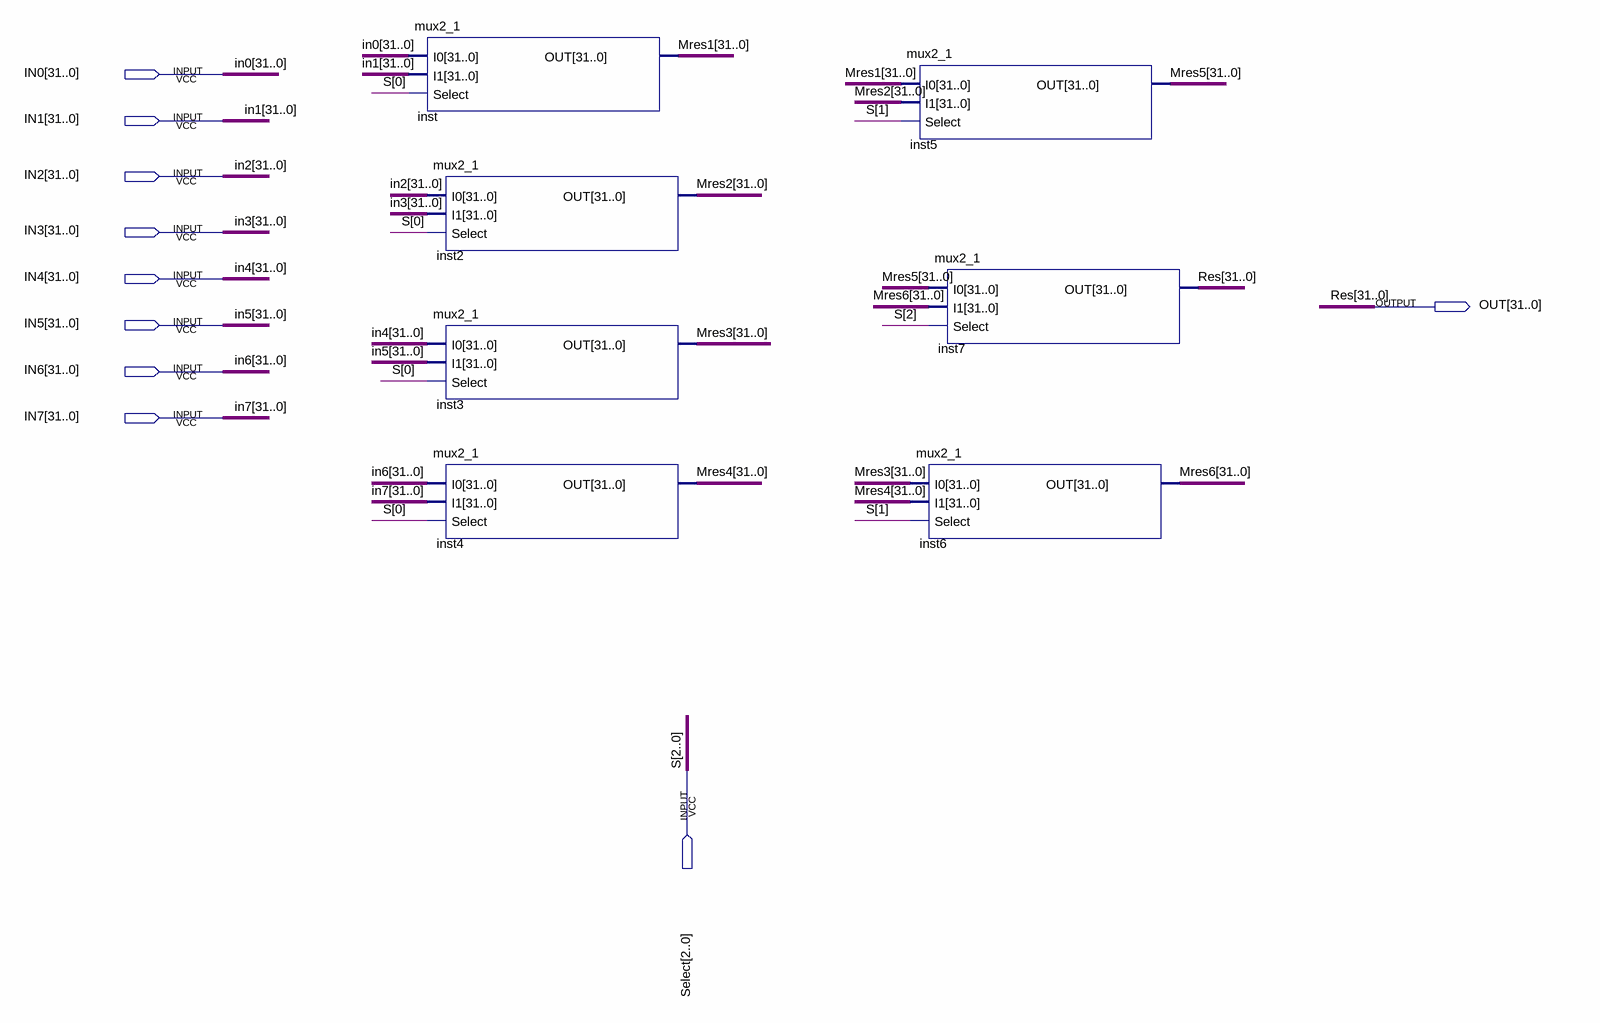
[diagram p0: schematic sheet]
// Quartus schematic mux8_1.bdf as structural Verilog: 7 symbols, 10 pins
module mux8_1 (
  input  [31:0] IN0,
  input  [31:0] IN1,
  input  [31:0] IN2,
  input  [31:0] IN3,
  input  [31:0] IN4,
  input  [31:0] IN5,
  input  [31:0] IN6,
  input  [31:0] IN7,
  input  [2:0] Select,
  output [31:0] OUT
);

  wire [31:0] Mres1, Mres2, Mres3, Mres4, Mres5, Mres6;

  mux2_1 inst (.I0(IN0), .I1(IN1), .Select(Select[0]), .OUT(Mres1));
  mux2_1 inst2 (.I0(IN2), .I1(IN3), .Select(Select[0]), .OUT(Mres2));
  mux2_1 inst3 (.I0(IN4), .I1(IN5), .Select(Select[0]), .OUT(Mres3));
  mux2_1 inst4 (.I0(IN6), .I1(IN7), .Select(Select[0]), .OUT(Mres4));
  mux2_1 inst5 (.I0(Mres1), .I1(Mres2), .Select(Select[1]), .OUT(Mres5));
  mux2_1 inst6 (.I0(Mres3), .I1(Mres4), .Select(Select[1]), .OUT(Mres6));
  mux2_1 inst7 (.I0(Mres5), .I1(Mres6), .Select(Select[2]), .OUT(OUT));

  // Other names for the same wires on the sheet: Res[31:0] = OUT; S[2:0] = Select
endmodule
